# EAGLE design steamy_streamer (EAGLE 9.6.2)
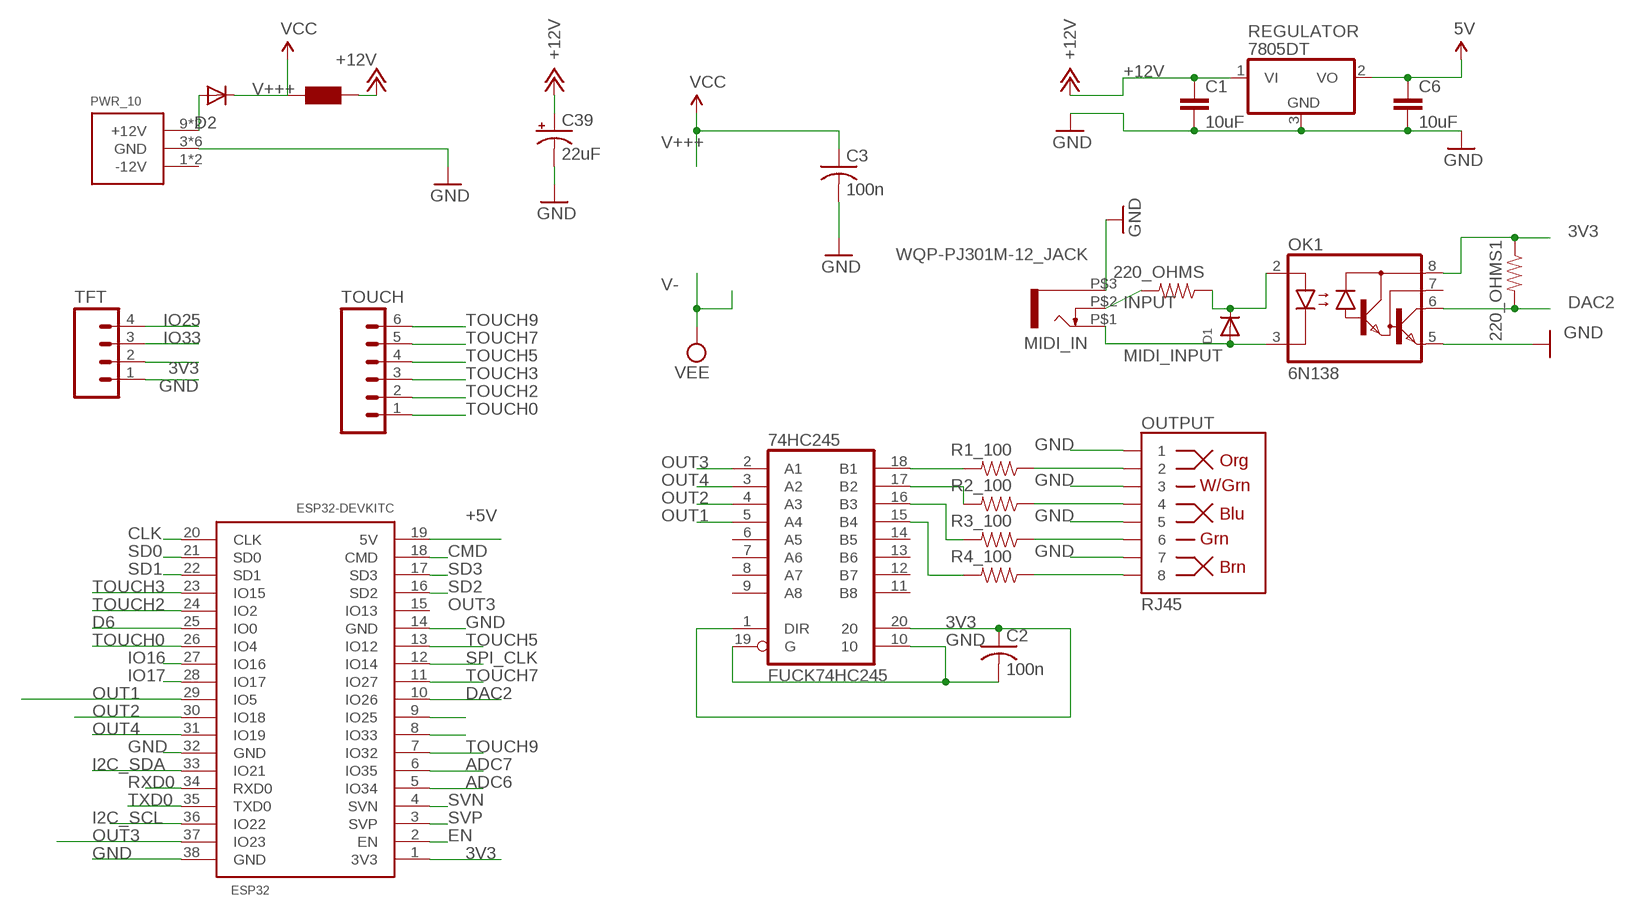
[diagram p0: schematic, sheet 1]

## Parts
74HC245  FUCK74HC245  [SO20W]
220_OHMS  RESISTOR1206  [1206]
220_OHMS1  RESISTOR1206  [1206]
C1  10uF  CAPACITOR1210  [R1210]
C2  100n  C-USC1206  [C1206]
C3  100n  C-USC1206  [C1206]
C6  10uF  CAPACITOR1210  [R1210]
C39  22uF  CAP_POL1206_TANT  [1206_POL]
D1  DIODESMA  [SMADIODE]
D2  B0450  DIODE-SOD123  [SOD123]
ESP32  ESP32DEVKITC  [ESP32-DEVKITC]
F1  Würth Electronics 742792664  FERRITE-BEAD0805  [R0805]
MIDI_IN  WQP-PJ301M-12_JACK  [WQP-PJ301M-12_JACK]
OK1  6N138  [DIL08]
OUTPUT  RJ45  RJ45-8PTH  [RJ45-8]
PWR_10  POWER_SIMPLE10  [POWER_10]
R1_100  RESISTOR1206  [1206]
R2_100  RESISTOR1206  [1206]
R3_100  RESISTOR1206  [1206]
R4_100  RESISTOR1206  [1206]
REGULATOR  7805DT  [TO252]
TFT  M04PTH  [1X04]
TOUCH  M06LOCK_LONGPADS  [1X06_LOCK_LONGPADS]

## Nets
3V3: 74HC245.1(DIR) 74HC245.20 220_OHMS1.1 C2.1 ESP32.1(3V3) OK1.8(VCC) TFT.2
4: OUTPUT.2 R1_100.1
+5V: C6.1 ESP32.19(5V) REGULATOR.2(VO) ; supply symbol labelled 5V
+12V: C1.1 C39.2(+) F1.1 REGULATOR.1(VI)
ADC6: ESP32.5(IO34)
ADC7: ESP32.6(IO35)
CLK: ESP32.20(CLK)
CMD: ESP32.18(CMD)
D6: ESP32.25(IO0)
DAC2: 220_OHMS1.2 ESP32.10(IO26) OK1.6(VO)
EN: ESP32.2(EN)
GND: 74HC245.10 74HC245.19(G) C1.2 C2.2 C3.2 C6.2 C39.1(-) ESP32.14(GND) ESP32.32(GND) ESP32.38(GND) MIDI_IN.P$3 OK1.5(GND) OUTPUT.1 OUTPUT.3 OUTPUT.5 OUTPUT.7 PWR_10.3(GND) PWR_10.4(GND) PWR_10.5(GND) PWR_10.6(GND) PWR_10.7(GND) PWR_10.8(GND) REGULATOR.3(GND) TFT.1
I2C_SCL: ESP32.36(IO22)
I2C_SDA: ESP32.33(IO21)
INPUT: 220_OHMS.2 MIDI_IN.P$2
IO16: ESP32.27(IO16)
IO17: ESP32.28(IO17)
IO25: ESP32.9(IO25) TFT.4
IO33: ESP32.8(IO33) TFT.3
MIDI_INPUT: D1.A MIDI_IN.P$1 OK1.3(C)
N$2: OUTPUT.8 R4_100.1
N$3: OUTPUT.6 R3_100.1
N$4: D2.A PWR_10.9(+12V) PWR_10.10(+12V)
N$5: OUTPUT.4 R2_100.1
N$6: 220_OHMS.1 D1.C OK1.2(A)
N$7: 74HC245.18(B1) R1_100.2
N$8: 74HC245.17(B2) R2_100.2
N$9: 74HC245.16(B3) R3_100.2
N$10: 74HC245.15(B4) R4_100.2
OUT1: 74HC245.5(A4) ESP32.29(IO5)
OUT2: 74HC245.4(A3) ESP32.30(IO18)
OUT3: 74HC245.2(A1) ESP32.37(IO23)
OUT4: 74HC245.3(A2) ESP32.31(IO19)
RXD0: ESP32.34(RXD0)
SD0: ESP32.21(SD0)
SD1: ESP32.22(SD1)
SD2: ESP32.16(SD2)
SD3: ESP32.17(SD3)
SPI_CLK: ESP32.12(IO14)
SVN: ESP32.4(SVN)
SVP: ESP32.3(SVP)
TOUCH0: ESP32.26(IO4) TOUCH.1
TOUCH2: ESP32.24(IO2) TOUCH.2
TOUCH3: ESP32.23(IO15) TOUCH.3
TOUCH5: ESP32.13(IO12) TOUCH.4
TOUCH7: ESP32.11(IO27) TOUCH.5
TOUCH9: ESP32.7(IO32) TOUCH.6
TXD0: ESP32.35(TXD0)
V+++: C3.1 D2.C F1.2 ; supply symbol labelled VCC
Unconnected: 74HC245.6(A5) 74HC245.7(A6) 74HC245.8(A7) 74HC245.9(A8) 74HC245.11(B8) 74HC245.12(B7) 74HC245.13(B6) 74HC245.14(B5) ESP32.15(IO13) OK1.7(VB) PWR_10.1(-12V) PWR_10.2(-12V)

## Library data of the parts
74HC245 = FUCK_74xx-eu:FUCK74HC245
220_OHMS 220_OHMS1 R1_100 R2_100 R3_100 R4_100 = SparkFun-Resistors:RESISTOR: Generic Resistor Package
C1 C6 = parts_aman:CAPACITOR
C2 C3 = rcl:C-US: CAPACITOR, American symbol; SPICEPREFIX: C
C39 = parts_aman:CAP_POL
D1 = adafruit:DIODE: Diode SMADIODE - SMA Surface Mount Package 20V 1A Schottky Diode Digikey: 641-1014-6-ND DO-1N4148 - Through Hole Small Current Diode SOD-123 20V 1 A (.5mV Vf) Schottky Diode - Digikey: MBRX120TPMSCT-ND SOD-323 10V 570mA (.38mV Vf, 3ns) Schottky Diode - Digikey: ZLLS410CT-ND SOD-523 30V 30mA Schottky Diode (RB751S-40TE61) - Digikey: RB751S-40TE61CT-ND SOT23-R/W - SOT23 Package (R = Solder Paste/Reflow Ovens, W = Hand-Soldering) BAT54Film 40V 300mA - Digikey: 497-7162-1-ND
D2 = diode:DIODE-: DIODE
ESP32 = ESP32-DEVKITC:ESP32DEVKITC
F1 = parts_aman:FERRITE-BEAD
MIDI_IN = thonkiconn:WQP-PJ301M-12_JACK
OK1 = optocoupler:6N138: MOTOROLA OPTO COUPLER; MF: VISHAY/TELEFUNKEN; MPN: 6N138; OC_FARNELL: 9860150; OC_NEWARK: 35K5294
OUTPUT = SparkFun-Connectors:RJ45-8: RJ45 Jack Simple RJ45, 8-pin connection - connector for common Cat5, Cat5e, and Cat6 Ethernet cables. Footprint not yet proven in production. Connector sku is PRT-00643; Breakout PCB sku is BOB-00716.; PROD_ID: CONN-08506
PWR_10 = parts_aman:POWER_SIMPLE
REGULATOR = linear:78*: Positive VOLTAGE REGULATOR Source: http://cache.national.com/ds/LM/LM78L05.pdf http://www.fairchildsemi.com/ds/LM/LM7805.pdf
TFT = SparkFun-Connectors:M04: Header 4 Standard 4-pin 0.1" header. Use with straight break away headers (SKU : PRT-00116), right angle break away headers (PRT-00553), swiss pins (PRT-00743), machine pins (PRT-00117), and female headers (PRT-00115). Molex polarized connector foot print use with SKU : PRT-08231 with associated crimp pins and housings. 1MM SMD Version SKU: PRT-10208
TOUCH = SparkFun-Connectors:M06: Header 6 Standard 6-pin 0.1" header. Use with straight break away headers (SKU : PRT-00116), right angle break away headers (PRT-00553), swiss pins (PRT-00743), machine pins (PRT-00117), and female headers (PRT-00115). Molex polarized connector foot print use with SKU : PRT-08094 with associated crimp pins and housings. NOTES ON THE VARIANTS LOCK and LOCK_LONGPADS... This footprint was designed to help hold the alignment of a through-hole component (i.e. 6-pin header) while soldering it into place. You may notice that each hole has been shifted either up or down by 0.005 of an inch from it's more standard position (which is a perfectly straight line). This slight alteration caused the pins (the squares in the middle) to touch the edges of the holes. Because they are alternating, it causes a "brace" to hold the component in place. 0.005 has proven to be the perfect amount of "off-center" position when using our standard breakaway headers. Although looks a little odd when you look at the bare footprint, once you have a header in there, the alteration is very hard to notice. Also,if you push a header all the way into place, it is covered up entirely on the bottom side. This idea of altering the position of holes to aid alignment will be further integrated into the Sparkfun Library for other footprints. It can help hold any component with 3 or more connection pins.

## Board
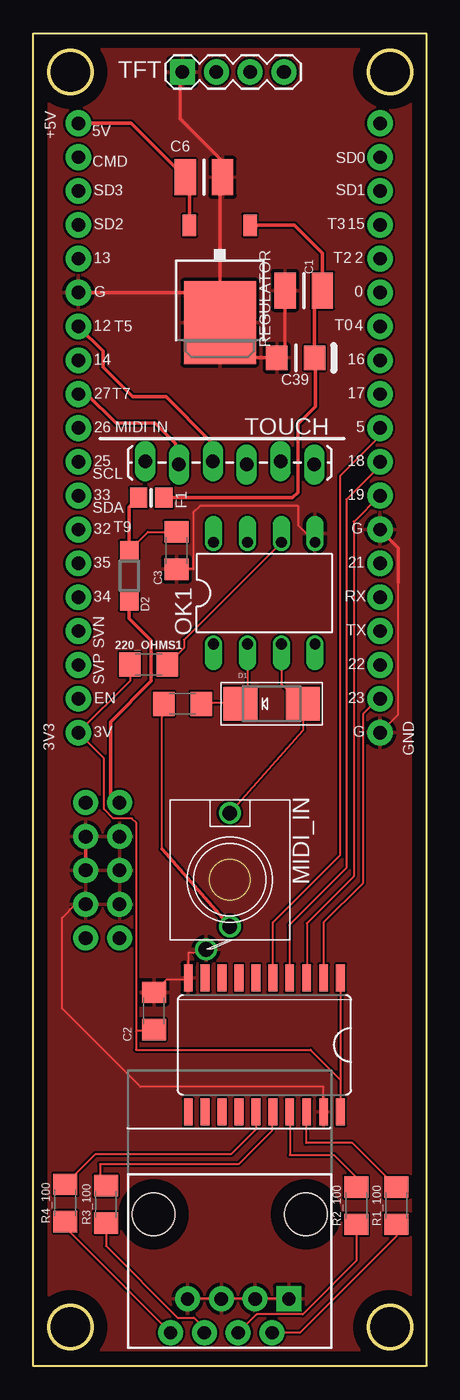
[diagram p1: board, top side]
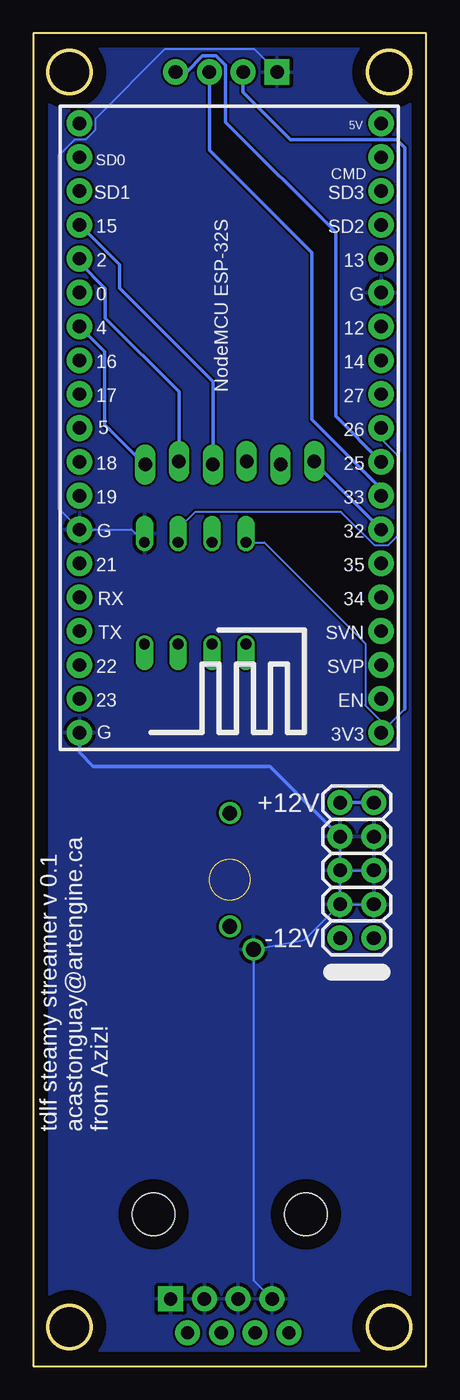
[diagram p2: board, bottom side, seen from below]

Size 29.5 x 100 mm. Coordinates in mm from the lower left corner, seen from the top.
Outline: 0,0 0,100 29.5,100 29.5,0 0,0
Outline: circle at 26.8,97.1 radius 1.62
Outline: circle at 2.8,97.1 radius 1.62
Outline: circle at 2.8,2.95 radius 1.62
Outline: circle at 26.8,2.95 radius 1.62
Copper layers (1*16): Top 0.035mm / dielectric 1.5mm / Bottom 0.035mm
Design rules "default": minimum track width 6mil, minimum drill 0.35mm, track to track 6mil, track to pad 6mil, pad to pad 6mil, via to via 6mil, smd to smd 6mil, copper to edge 40mil, drill to drill 6mil, minimum pad ring 10mil, minimum via ring 8mil, stop-mask expansion 4mil, vias tented up to drill 0mil, thermal gap 10mil

### Footprints (pad centres in the part's own frame; a part is rotated, then mirrored left to right if it is on the bottom)
SO20W = smd 0.66 x 2.032: 1 -5.715,-5.029; 2 -4.445,-5.029; 3 -3.175,-5.029; 4 -1.905,-5.029; 5 -0.635,-5.029; 6 0.635,-5.029; 7 1.905,-5.029; 8 3.175,-5.029; 9 4.445,-5.029; 10 5.715,-5.029; 11 5.715,5.029; 12 4.445,5.029; 13 3.175,5.029; 14 1.905,5.029; 15 0.635,5.029; 16 -0.635,5.029; 17 -1.905,5.029; 18 -3.175,5.029; 19 -4.445,5.029; 20 -5.715,5.029
1206 = smd 1.6 x 1.8: 1 -1.4,0; 2 1.4,0
R1210 = smd 1.6 x 2.7: 1 -1.4,0; 2 1.4,0
C1206 = smd 1.6 x 1.8: 1 -1.4,0; 2 1.4,0
1206_POL = smd 1.6 x 1.803: 1 -1.422,0; 2 1.422,0
SMADIODE = smd 2.54 x 2.54: A 2.349,0; C -2.349,0
SOD123 = smd 1.4 x 1.4: A 1.9,0; C -1.9,0
ESP32-DEVKITC = drill 1 pad 1.93: 1 -22.87,-11.42; 2 -20.33,-11.42; 3 -17.79,-11.42; 4 -15.25,-11.42; 5 -12.71,-11.42; 6 -10.17,-11.42; 7 -7.63,-11.42; 8 -5.09,-11.42; 9 -2.55,-11.42; 10 -0.01,-11.42; 11 2.53,-11.42; 12 5.07,-11.42; 13 7.61,-11.42; 14 10.15,-11.42; 15 12.69,-11.42; 16 15.23,-11.42; 17 17.77,-11.42; 18 20.31,-11.42; 19 22.85,-11.42; 20 22.85,11.23; 21 20.31,11.23; 22 17.77,11.23; 23 15.23,11.23; 24 12.69,11.23; 25 10.15,11.23; 26 7.61,11.23; 27 5.07,11.23; 28 2.53,11.23; 29 -0.01,11.23; 30 -2.55,11.23; 31 -5.09,11.23; 32 -7.63,11.23; 33 -10.17,11.23; 34 -12.71,11.23; 35 -15.25,11.23; 36 -17.79,11.23; 37 -20.33,11.23; 38 -22.87,11.23
R0805 = smd 1.3 x 1.5: 1 -0.95,0; 2 0.95,0
WQP-PJ301M-12_JACK = drill 1.1: P$1 0,5; P$2 0,-3.5; P$3 -1.778,-5.23
DIL08 = drill 0.813 offset: 1 -3.81,-3.81; 2 -1.27,-3.81; 3 1.27,-3.81; 4 3.81,-3.81; 5 3.81,3.81; 6 1.27,3.81; 7 -1.27,3.81; 8 -3.81,3.81
RJ45-8 = drill 1 pad 1.88 square: 1 -4.445,6.35 | drill 1 pad 1.88: 2 -3.175,8.89; 3 -1.905,6.35; 4 -0.635,8.89; 5 0.635,6.35; 6 1.905,8.89; 7 3.175,6.35; 8 4.445,8.89 | hole 3.2: -5.715,0; 5.715,0
POWER_10 = drill 1.016 pad 1.88: 1 -5.08,-1.27; 2 -5.08,1.27; 3 -2.54,-1.27; 4 -2.54,1.27; 5 0,-1.27; 6 0,1.27; 7 2.54,-1.27; 8 2.54,1.27; 9 5.08,-1.27; 10 5.08,1.27
TO252 = smd 1 x 1.6: 1 -2.28,-4.8; 2 2.28,-4.8 | smd 5.4 x 6.2: 3 0,2.5
1X04 = drill 1.016 pad 1.88 square: 1 0,0 | drill 1.016 pad 1.88: 2 2.54,0; 3 5.08,0; 4 7.62,0
1X06_LOCK_LONGPADS = drill 1.016 long: 1 0,0; 2 2.54,-0.254; 3 5.08,0; 4 7.62,-0.254; 5 10.16,0; 6 12.7,-0.254

### Placement (x,y rotation side)
74HC245  17.35,24.1 180 top
220_OHMS  11.2,49.7 180 top
220_OHMS1  8.65,52.65 0 top
C1  20.3,80.7 180 top
C2  9.05,26.65 90 top
C3  10.75,61.2 270 top
C6  12.8,89.2 0 top
C39  19.7,75.65 0 top
D1  17.9,49.7 0 top
D2  7.2,59.3 270 top
ESP32  14.8,70.4 90 bottom
F1  8.85,65.15 180 top
MIDI_IN  14.75,36.5 0 top
OK1  17.35,58 0 top
OUTPUT  14.75,11.4 180 top
PWR_10  5.2,37.2 90 bottom
R1_100  27.25,12.05 90 top
R2_100  24.25,12.05 90 top
R3_100  5.45,12.15 90 top
R4_100  2.4,12.25 90 top
REGULATOR  14,80.8 180 top
TFT  11.2,97.1 0 top
TOUCH  21.1,67.65 180 top

### Tracks (layer width: path | path; a pad name or v marks a point on that pad's centre or on a via)
3V3
  Top 0.152: 7.7,25.15 7.7,40.8 7.39,41.11 5.99,41.11 5.3,41.8 5.3,45.61 ESP32.1 7.25,51.4 220_OHMS1.1 | 7.7,25.15 7.7,23.75 20.82,23.75 23.07,21.5 | 74HC245.1 23.07,21.5 | 23.07,21.5 74HC245.20 | C2.1 8.95,25.15 7.7,25.15
  Bottom 0.152: OK1.8 12.16,61.81 4.57,54.22 4.57,49.58 3.38,48.38 ESP32.1
  Bottom 0.2: ESP32.1 1.6,49.31
  Bottom 0.254: TFT.2 13.74,95.56 10.18,92 2.21,92 1.6,91.4 1.6,49.31
4
  Top 0.152: OUTPUT.2 20.02,2.51 27.25,9.73 R1_100.1
+5V
  Top 0.254: REGULATOR.2 11.72,88.88 C6.1 7.35,93.25 ESP32.19
+12V
  Top 0.254: F1.1 19.45,65.15 19.85,65.55 19.85,70.68 21.17,72 21.17,75.6 C39.2 21.12,80.12 C1.1 21.7,83.5 19.6,85.6 REGULATOR.1
DAC2
  Top 0.152: OK1.6 11.3,54.49 11.3,53.9 220_OHMS1.2
  Bottom 0.152: ESP32.10 3.38,69.54 2.19,68.34 2.19,62.28 2.89,61.58 3.87,61.58 6.4,64.1 17.35,64.1 18.62,62.83 OK1.6
GND
  Top 0.152: 27.4,58.8 27.4,48.9 ESP32.38 | OUTPUT.1 OUTPUT.3 OUTPUT.5 OUTPUT.7 | MIDI_IN.P$3 12,31 11.63,31 74HC245.10 11.53,29.02 10.02,29.02 C2.2 | 74HC245.19 21.8,20.95 8.04,20.95 2.15,26.84 2.15,33.65 3.16,34.66 PWR_10.3 | OK1.5 19.9,63.07 19.9,64.55 12.5,64.55 12,64.05 12,59.8 C3.2
  Top 0.254: PWR_10.5 PWR_10.7 | 14,80.3 REGULATOR.3 16.65,75.65 C39.1 18.9,76.27 C1.2 | 14,80.3 14,89 C6.2 14.2,90.4 11,93.6 11,96.9 TFT.1 | ESP32.14 13.75,80.55 14,80.3 | 27.4,58.8 27.4,61.4 ESP32.32
  Bottom 0.152: PWR_10.8 PWR_10.6 | PWR_10.6 PWR_10.5 | PWR_10.6 6.47,35.85 6.54,35.78 6.47,35.71 PWR_10.4 | PWR_10.4 PWR_10.3 | TFT.1 12.93,98.83 19.6,98.83 24.84,93.59 24.84,92.76 25.54,92.06 26.37,92.06 27.6,90.83 27.6,64.34 ESP32.32 22.12,62.77 OK1.5 | PWR_10.4 9.16,31.97 MIDI_IN.P$3 12.97,6.45 OUTPUT.7
  Bottom 0.254: PWR_10.8 11.73,45 25,45 26.03,46.03 ESP32.38
  pour Bottom: 29,99.8 29.4,99.8 29.4,1 29.5,0.3 0.7,0.3 0.3,0.5 0.2,99.8
  pour Top: 0.5,99.7 29.29,99.7 29.29,0.3 0.3,0.3 0.3,99.7 0.5,99.9
INPUT
  Top 0.152: 9.65,38.8 9.65,49.55 220_OHMS.2
  Top 0.254: MIDI_IN.P$2 9.65,38.8
IO25
  Bottom 0.254: ESP32.9 6.8,71.27 6.8,85.08 15.06,93.34 15.06,97.61 15.78,98.32 16.79,98.32 18,97.1 TFT.4
IO33
  Bottom 0.254: ESP32.8 3.38,65.81 8.6,71.03 8.6,83.45 8.6,83.55 16.28,91.23 TFT.3
MIDI_INPUT
  Top 0.152: D1.A 20.25,49.55 | 20.25,49.55 20.25,47.7 MIDI_IN.P$1 | OK1.3 18.62,51.18 20.25,49.55
N$2
  Top 0.152: R4_100.1 2.4,10.41 OUTPUT.8
N$3
  Top 0.152: R3_100.1 5.45,9.02 10.82,3.65 12.05,3.65 12.85,2.85 OUTPUT.6
N$4
  Top 0.254: D2.A 7.2,56.1 8.85,54.45 8.85,51.4 5.8,48.35 5.8,42.95 PWR_10.10
  Bottom 0.254: PWR_10.10 PWR_10.9
N$5
  Top 0.152: OUTPUT.4 16.76,3.88 20.23,3.88 24.25,7.9 R2_100.1
N$6
  Top 0.152: OK1.2 16.08,50.23 D1.C 15.47,49.77 12.68,49.77 220_OHMS.1
N$7
  Top 0.152: R1_100.2 23.95,16.75 20.48,16.75 20.48,19.02 74HC245.18
N$8
  Top 0.152: R2_100.2 24.25,14.17 22.58,15.84 19.25,15.84 74HC245.17
N$9
  Top 0.152: R3_100.2 5,14 5,15.15 15.4,15.15 17.9,17.65 17.9,18.99 74HC245.16
N$10
  Top 0.152: R4_100.2 4.65,15.9 14.85,15.9 16.71,17.77 74HC245.15
OUT1
  Top 0.152: ESP32.29 26.03,69.79 23.05,66.81 23.05,38.36 17.98,33.3 74HC245.5
OUT2
  Top 0.152: ESP32.30 26.03,67.55 23.5,65.03 23.5,37.38 19.23,33.1 19.23,29.15 74HC245.4
OUT3
  Top 0.152: ESP32.37 25.87,50.07 24.75,48.95 24.75,36.23 21.8,33.28 74HC245.2
OUT4
  Top 0.152: ESP32.31 24.1,63.38 24.05,63.38 24.05,36.75 20.52,33.23 74HC245.3
TOUCH0
  Bottom 0.254: ESP32.26 24.15,76.13 24.15,70.65 21.15,67.65 TOUCH.1
TOUCH2
  Bottom 0.254: ESP32.24 26.03,82.79 24.1,80.86 24.1,78.64 18.56,73.1 TOUCH.2
TOUCH3
  Bottom 0.254: ESP32.23 23.03,82.63 23.03,80.88 16.02,73.87 TOUCH.3
TOUCH5
  Top 0.254: ESP32.13 5.25,76.14 5.25,74.95 7.45,72.75 9.95,72.75 13.28,69.42 TOUCH.4
TOUCH7
  Top 0.254: ESP32.11 4.02,72.93 6.2,70.75 9.15,70.75 10.69,69.21 10.69,67.7 TOUCH.5
TOUCH9
  Bottom 0.254: ESP32.7 8.2,67.59 TOUCH.6
V+++
  Top 0.152: D2.C 8.6,62.6 C3.1
  Top 0.254: F1.2 7.2,64.45 D2.C

### Text on the board
tPlace: 3V3
tNames: +5V | T3 | T2 | T5 | T0 | T7 | MIDI IN | SCL | SDA | T9 | GND
bNames: +12V | -12V | tdlf steamy streamer v 0.1 / acastonguay@artengine.ca / from Aziz!